# Altium schematic sheet LED.SchDoc
size 594 x 420 mm; Address1: Address1; Address2: Address2; Address3: Address3; Address4: Address4; DocumentNumber: АБВГ.123456.001 Э3; SheetNumber: 2; SheetTotal: 2; Scale: 1:1; DocumentType: Схема электрическая принципиальная; FirstReferrence: АБВГ.123456.001
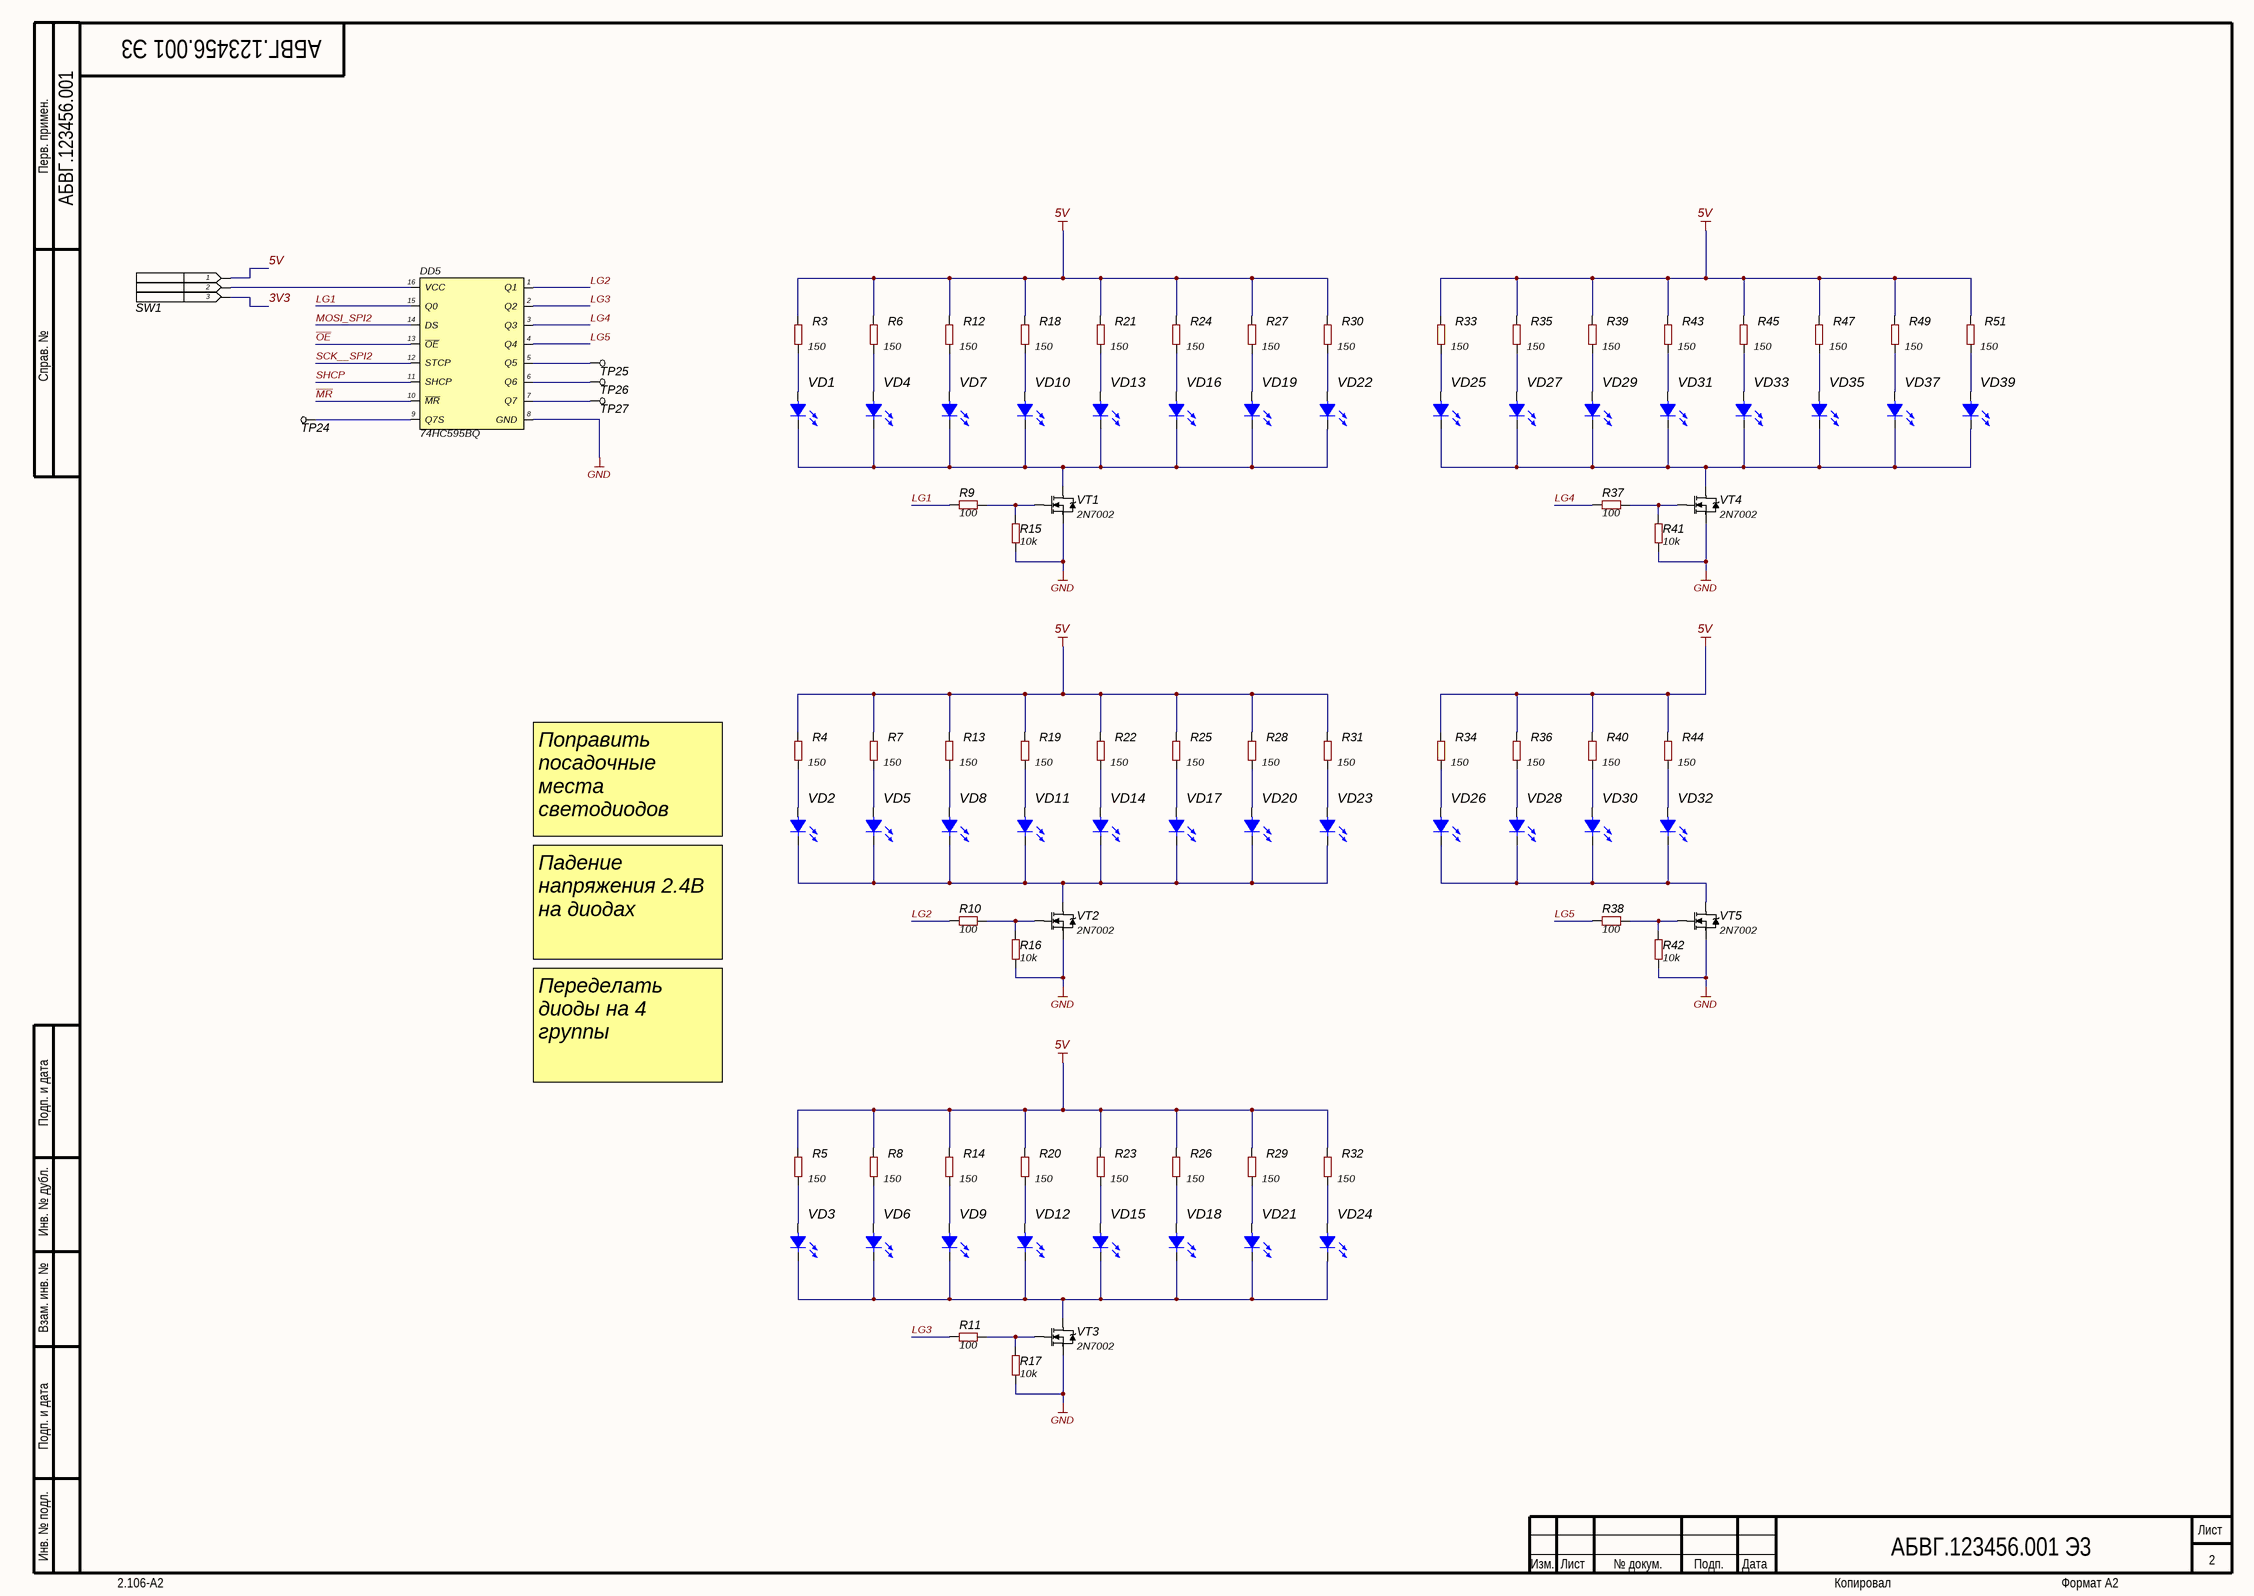
[diagram p0: LED.SchDoc]

## Parts
DD5  74HC595BQ  [16-DHVQFN]
R3  value 150  [RES: 0603]
R4  value 150  [RES: 0603]
R5  value 150  [RES: 0603]
R6  value 150  [RES: 0603]
R7  value 150  [RES: 0603]
R8  value 150  [RES: 0603]
R9  value 100  [RES: 0603]
R10  value 100  [RES: 0603]
R11  value 100  [RES: 0603]
R12  value 150  [RES: 0603]
R13  value 150  [RES: 0603]
R14  value 150  [RES: 0603]
R15  value 10k  [RES: 0603]
R16  value 10k  [RES: 0603]
R17  value 10k  [RES: 0603]
R18  value 150  [RES: 0603]
R19  value 150  [RES: 0603]
R20  value 150  [RES: 0603]
R21  value 150  [RES: 0603]
R22  value 150  [RES: 0603]
R23  value 150  [RES: 0603]
R24  value 150  [RES: 0603]
R25  value 150  [RES: 0603]
R26  value 150  [RES: 0603]
R27  value 150  [RES: 0603]
R28  value 150  [RES: 0603]
R29  value 150  [RES: 0603]
R30  value 150  [RES: 0603]
R31  value 150  [RES: 0603]
R32  value 150  [RES: 0603]
R33  value 150  [RES: 0603]
R34  value 150  [RES: 0603]
R35  value 150  [RES: 0603]
R36  value 150  [RES: 0603]
R37  value 100  [RES: 0603]
R38  value 100  [RES: 0603]
R39  value 150  [RES: 0603]
R40  value 150  [RES: 0603]
R41  value 10k  [RES: 0603]
R42  value 10k  [RES: 0603]
R43  value 150  [RES: 0603]
R44  value 150  [RES: 0603]
R45  value 150  [RES: 0603]
R47  value 150  [RES: 0603]
R49  value 150  [RES: 0603]
R51  value 150  [RES: 0603]
SW1  Jumper  [JUM: 0603_3P]  (value not drawn)
TP24  Testpoint_HS1mm  [TestPoint(without hole)]  (value not drawn)
TP25  Testpoint_HS1mm  [TestPoint(without hole)]  (value not drawn)
TP26  Testpoint_HS1mm  [TestPoint(without hole)]  (value not drawn)
TP27  Testpoint_HS1mm  [TestPoint(without hole)]  (value not drawn)
VD1  (no value)  [LED: 1206Y]
VD2  (no value)  [LED: 1206Y]
VD3  (no value)  [LED: 1206Y]
VD4  (no value)  [LED: 1206Y]
VD5  (no value)  [LED: 1206Y]
VD6  (no value)  [LED: 1206Y]
VD7  (no value)  [LED: 1206Y]
VD8  (no value)  [LED: 1206Y]
VD9  (no value)  [LED: 1206Y]
VD10  (no value)  [LED: 1206Y]
VD11  (no value)  [LED: 1206Y]
VD12  (no value)  [LED: 1206Y]
VD13  (no value)  [LED: 1206Y]
VD14  (no value)  [LED: 1206Y]
VD15  (no value)  [LED: 1206Y]
VD16  (no value)  [LED: 1206Y]
VD17  (no value)  [LED: 1206Y]
VD18  (no value)  [LED: 1206Y]
VD19  (no value)  [LED: 1206Y]
VD20  (no value)  [LED: 1206Y]
VD21  (no value)  [LED: 1206Y]
VD22  (no value)  [LED: 1206Y]
VD23  (no value)  [LED: 1206Y]
VD24  (no value)  [LED: 1206Y]
VD25  (no value)  [LED: 1206Y]
VD26  (no value)  [LED: 1206Y]
VD27  (no value)  [LED: 1206Y]
VD28  (no value)  [LED: 1206Y]
VD29  (no value)  [LED: 1206Y]
VD30  (no value)  [LED: 1206Y]
VD31  (no value)  [LED: 1206Y]
VD32  (no value)  [LED: 1206Y]
VD33  (no value)  [LED: 1206Y]
VD35  (no value)  [LED: 1206Y]
VD37  (no value)  [LED: 1206Y]
VD39  (no value)  [LED: 1206Y]
VT1  PartNumber: 2N7002  [SOT23]
VT2  PartNumber: 2N7002  [SOT23]
VT3  PartNumber: 2N7002  [SOT23]
VT4  PartNumber: 2N7002  [SOT23]
VT5  PartNumber: 2N7002  [SOT23]

## Nets
5V: R3.2 R4.2 R5.2 R6.2 R7.2 R8.2 R12.2 R13.2 R14.2 R18.2 R19.2 R20.2 R21.2 R22.2 R23.2 R24.2 R25.2 R26.2 R27.2 R28.2 R29.2 R30.2 R31.2 R32.2 R33.2 R34.2 R35.2 R36.2 R39.2 R40.2 R43.2 R44.2 R45.2 R47.2 R49.2 R51.2 SW1.1
GND: DD5.8(GND) R15.1 R16.1 R17.1 R41.1 R42.1 VT1.2(S) VT2.2(S) VT3.2(S) VT4.2(S) VT5.2(S)
3V3: SW1.3
LG1: DD5.15(Q0) R9.1
LG2: DD5.1(Q1) R10.1
LG3: DD5.2(Q2) R11.1
LG4: DD5.3(Q3) R37.1
LG5: DD5.4(Q4) R38.1
~{MR}: DD5.10(~{MR})
MOSI_SPI2: DD5.14(DS)
~{OE}: DD5.13(~{OE})
SCK__SPI2: DD5.12(STCP)
SHCP: DD5.11(SHCP)
NetDD5_5: DD5.5(Q5) TP25.1
NetDD5_6: DD5.6(Q6) TP26.1
NetDD5_7: DD5.7(Q7) TP27.1
NetDD5_9: DD5.9(Q7S) TP24.1
NetDD5_16: DD5.16(VCC) SW1.2
NetR3_1: R3.1 VD1.1(A)
NetR4_1: R4.1 VD2.1(A)
NetR5_1: R5.1 VD3.1(A)
NetR6_1: R6.1 VD4.1(A)
NetR7_1: R7.1 VD5.1(A)
NetR8_1: R8.1 VD6.1(A)
NetR9_2: R9.2 R15.2 VT1.1(G)
NetR10_2: R10.2 R16.2 VT2.1(G)
NetR11_2: R11.2 R17.2 VT3.1(G)
NetR12_1: R12.1 VD7.1(A)
NetR13_1: R13.1 VD8.1(A)
NetR14_1: R14.1 VD9.1(A)
NetR18_1: R18.1 VD10.1(A)
NetR19_1: R19.1 VD11.1(A)
NetR20_1: R20.1 VD12.1(A)
NetR21_1: R21.1 VD13.1(A)
NetR22_1: R22.1 VD14.1(A)
NetR23_1: R23.1 VD15.1(A)
NetR24_1: R24.1 VD16.1(A)
NetR25_1: R25.1 VD17.1(A)
NetR26_1: R26.1 VD18.1(A)
NetR27_1: R27.1 VD19.1(A)
NetR28_1: R28.1 VD20.1(A)
NetR29_1: R29.1 VD21.1(A)
NetR30_1: R30.1 VD22.1(A)
NetR31_1: R31.1 VD23.1(A)
NetR32_1: R32.1 VD24.1(A)
NetR33_1: R33.1 VD25.1(A)
NetR34_1: R34.1 VD26.1(A)
NetR35_1: R35.1 VD27.1(A)
NetR36_1: R36.1 VD28.1(A)
NetR37_2: R37.2 R41.2 VT4.1(G)
NetR38_2: R38.2 R42.2 VT5.1(G)
NetR39_1: R39.1 VD29.1(A)
NetR40_1: R40.1 VD30.1(A)
NetR43_1: R43.1 VD31.1(A)
NetR44_1: R44.1 VD32.1(A)
NetR45_1: R45.1 VD33.1(A)
NetR47_1: R47.1 VD35.1(A)
NetR49_1: R49.1 VD37.1(A)
NetR51_1: R51.1 VD39.1(A)
NetVD1_2: VD1.2(C) VD4.2(C) VD7.2(C) VD10.2(C) VD13.2(C) VD16.2(C) VD19.2(C) VD22.2(C) VT1.3(D)
NetVD2_2: VD2.2(C) VD5.2(C) VD8.2(C) VD11.2(C) VD14.2(C) VD17.2(C) VD20.2(C) VD23.2(C) VT2.3(D)
NetVD3_2: VD3.2(C) VD6.2(C) VD9.2(C) VD12.2(C) VD15.2(C) VD18.2(C) VD21.2(C) VD24.2(C) VT3.3(D)
NetVD25_2: VD25.2(C) VD27.2(C) VD29.2(C) VD31.2(C) VD33.2(C) VD35.2(C) VD37.2(C) VD39.2(C) VT4.3(D)
NetVD26_2: VD26.2(C) VD28.2(C) VD30.2(C) VD32.2(C) VT5.3(D)

## Notes on the sheet
- Поправить посадочные места светодиодов
- Падение напряжения 2.4В на диодах
- Переделать диоды на 4 группы
- Перв. примен.
- Справ. №
- Подп. и дата
- Инв. № дубл.
- Взам. инв. №
- Инв. № подл.
- Изм.
- Лист
- № докум.
- Подп.
- Дата
- 2.106-A2
- Копировал
- Формат А2

## Library data of the parts
R3-R45 R47 R49 R51 = Resistor_0603: Manufacturer: Yageo; PartNumber: RC0603JR-07100RL; TypeResistor: Resistor film; Power: 0.1W; Package: 0603; HelpURL: https://www.digikey.com/product-detail/en/yageo/RC0603JR-07100RL/311-100GRCT-ND/729644; ValueManufacturerPartNumber: =TypeResistor+', '+Value+', '+Tolerance+', '+Package+', '+Power+', '+Temperature; Temperature: -55...+125°C
SW1 = Jumper: N/C
VD1-VD33 VD35 VD37 VD39 = LED_single: ValueManufacturerPartNumber: LED, Green, *, *, *, -55...+150°C; TypeDiode: LED; ColorParameter: Green; Manufacturer: *; Package: *; HelpURL: *; Temperature: -55...+150°C; Current: *; VoltageDrop: *; PartNumber: *; Color: GREEN
VT1-VT5 = MOSFET_N_132: Manufacturer: Infineon Technologies; ValueManufacturerPartNumber: MOSFET N-channel transistor, 80V, 7A, 9.1nC, 2.5W, 34mOhm, 756pF, 8-TDSON, -55...+150°C; TypeTransistor: MOSFET N-channel transistor; VoltageDS: 80V; CurrentDS: 7A; RDS: 34mOhm; GateCharge: 9.1nC; InputCapacitor: 756pF; MaxPower: 2.5W; Package: 8-TDSON; HelpURL: https://www.digikey.com/product-detail/en/infineon-technologies/BSC340N08NS3GATMA1/BSC340N08NS3GATMA1TR-ND/2080655; Temperature: -55...+150°C
DD5 = 74HC595BQ: ComponentLink1Description: Information; ComponentLink1URL: https://www.nexperia.com/products/analog-logic-ics/logic/flip-flops-latches-registers-counters-dividers/shift-registers/74HC595BQ.html